# Altium schematic sheet Banks_5_6.SchDoc: FPGA Motherboard for Digital Multiplexed Readout, McGill U.
size B; DocumentNumber: DfMUX4; Revision: Rev0, Prototype; SheetNumber: 4; SheetTotal: 27; PageSetup: Record=PageOptions|CenterHorizontal=True|CenterVertical=True|PrintScale=1.08|XCorrection=1.00|YCorrection=1.00|PrintKind=0|BorderSize=5000000|LeftOffset=0|BottomOffset=0|Orientation=2|PaperLength=1000|PaperWidth=1000|Scale=100|PaperSource=7|PrintQuality=-4|MediaType=1|DitherType=10|PaperKind=Tabloid|PrintScaleMode=1
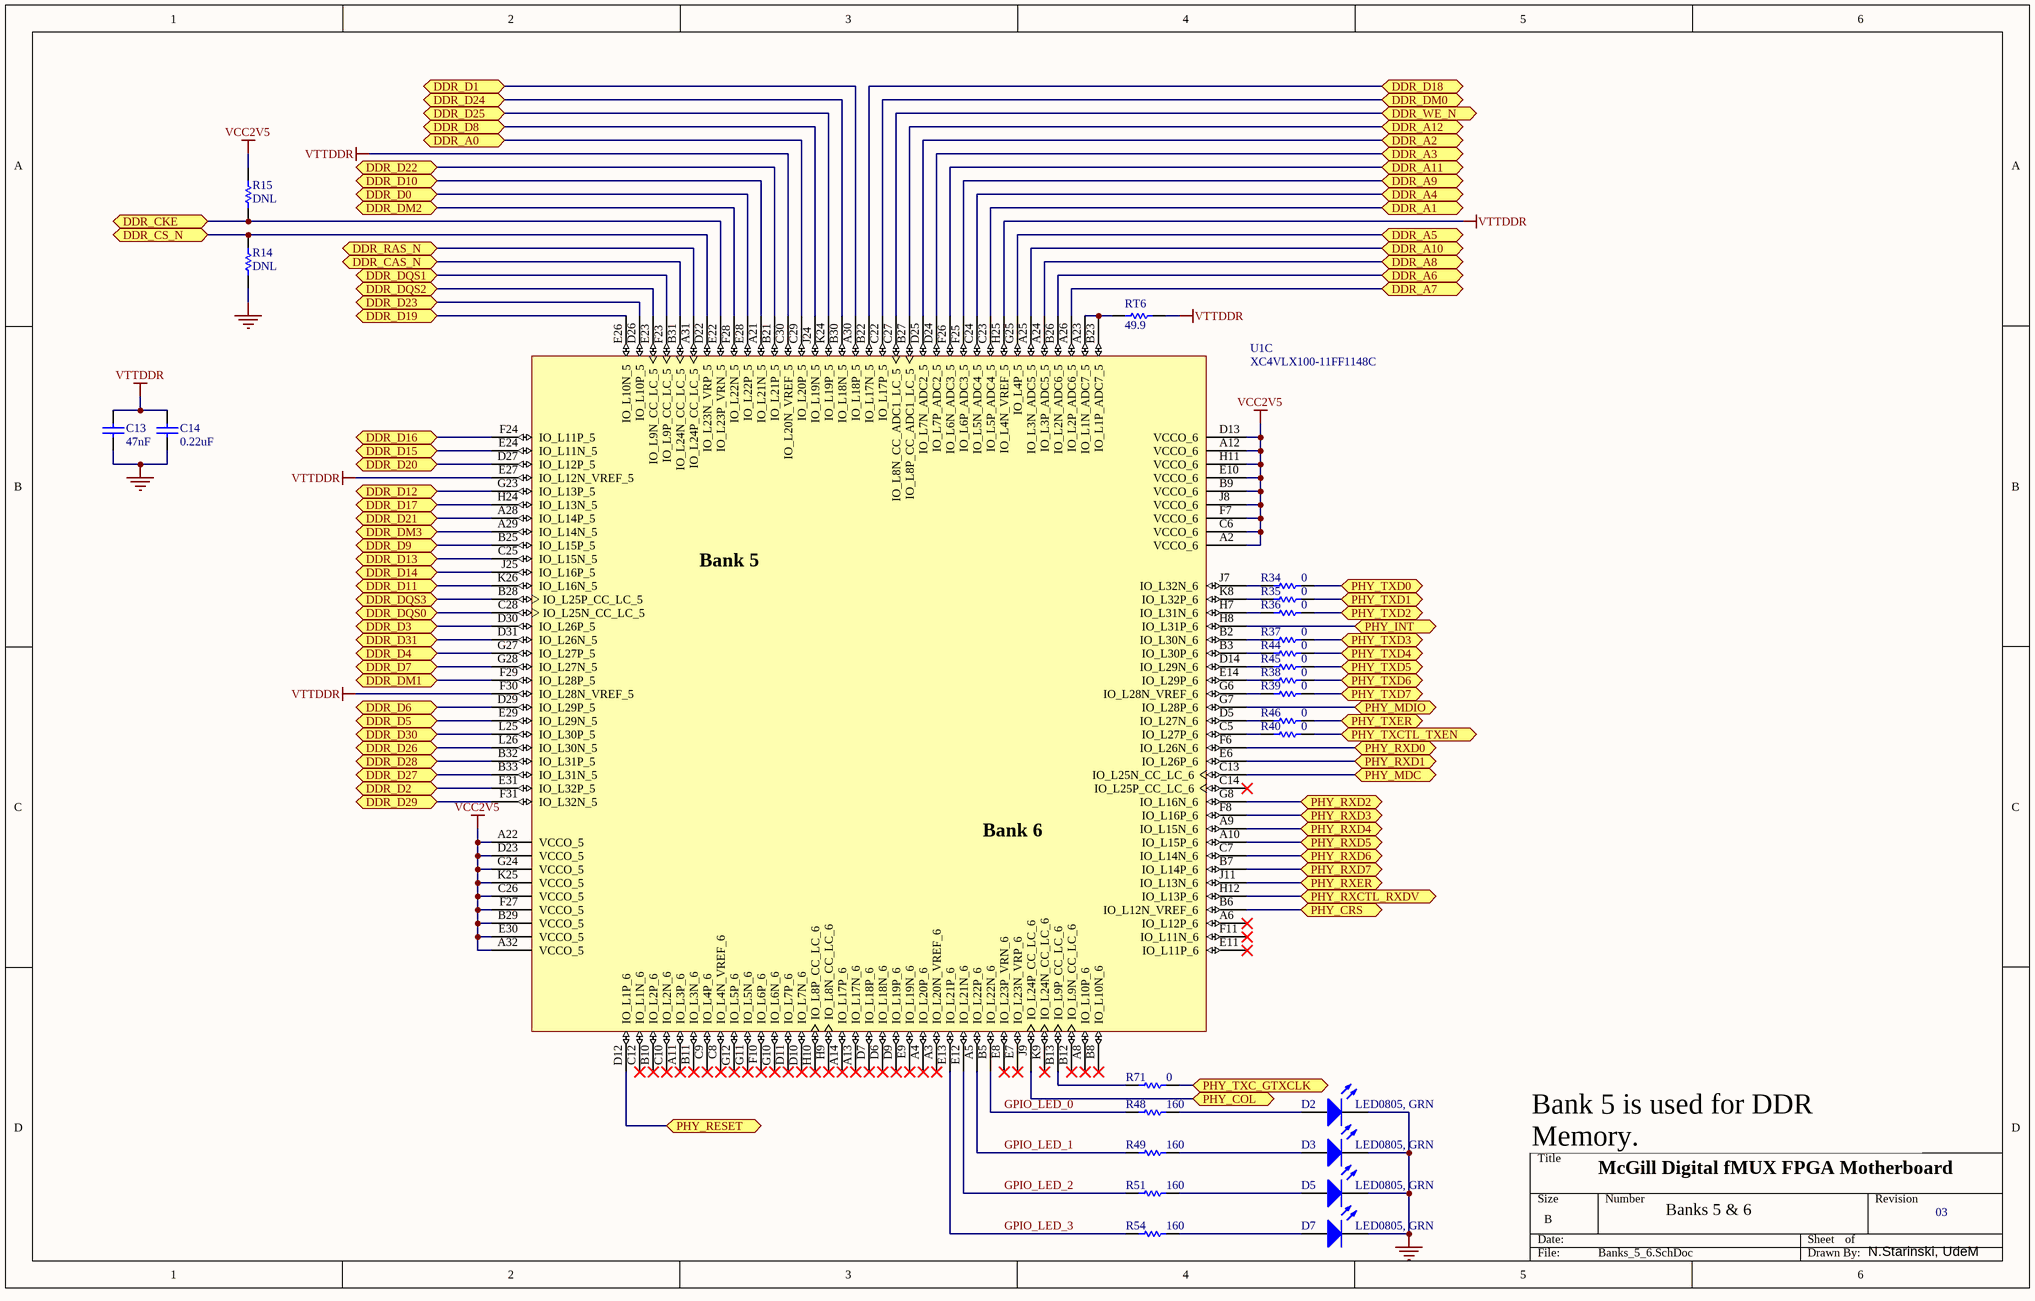
[diagram p0: Banks_5_6.SchDoc]

## Parts
C13  47nF  [CC1005-0402]
C14  0.22uF  [CC1608-0603]
D2  LED0805, GRN  [SMD _LED]
D3  LED0805, GRN  [SMD _LED]
D5  LED0805, GRN  [SMD _LED]
D7  LED0805, GRN  [SMD _LED]
R14  DNL  [CR1608-0603]
R15  DNL  [CR1608-0603]
R34  0  [CR1608-0603]
R35  0  [CR1608-0603]
R36  0  [CR1608-0603]
R37  0  [CR1608-0603]
R38  0  [CR1608-0603]
R39  0  [CR1608-0603]
R40  0  [CR1608-0603]
R44  0  [CR1608-0603]
R45  0  [CR1608-0603]
R46  0  [CR1608-0603]
R48  160  [CR1608-0603]
R49  160  [CR1608-0603]
R51  160  [CR1608-0603]
R54  160  [CR1608-0603]
R71  0  [CR1608-0603]
RT6  49.9  [CR1608-0603]
U1  XC4VLX100-11FF1148C  [FF1148]  (part C of 10)

## Ports
DDR_A0 (bidir), DDR_A1 (bidir), DDR_A2 (bidir), DDR_A3 (bidir), DDR_A4 (bidir), DDR_A5 (bidir), DDR_A6 (bidir), DDR_A7 (bidir), DDR_A8 (bidir), DDR_A9 (bidir), DDR_A10 (bidir), DDR_A11 (bidir), DDR_A12 (bidir), DDR_CAS_N (bidir), DDR_CKE (bidir), DDR_CS_N (bidir), DDR_D0 (bidir), DDR_D1 (bidir), DDR_D2 (bidir), DDR_D3 (bidir), DDR_D4 (bidir), DDR_D5 (bidir), DDR_D6 (bidir), DDR_D7 (bidir), DDR_D8 (bidir), DDR_D9 (bidir), DDR_D10 (bidir), DDR_D11 (bidir), DDR_D12 (bidir), DDR_D13 (bidir), DDR_D14 (bidir), DDR_D15 (bidir), DDR_D16 (bidir), DDR_D17 (bidir), DDR_D18 (bidir), DDR_D19 (bidir), DDR_D20 (bidir), DDR_D21 (bidir), DDR_D22 (bidir), DDR_D23 (bidir), DDR_D24 (bidir), DDR_D25 (bidir), DDR_D26 (bidir), DDR_D27 (bidir), DDR_D28 (bidir), DDR_D29 (bidir), DDR_D30 (bidir), DDR_D31 (bidir), DDR_DM0 (bidir), DDR_DM1 (bidir), DDR_DM2 (bidir), DDR_DM3 (bidir), DDR_DQS0 (bidir), DDR_DQS1 (bidir), DDR_DQS2 (bidir), DDR_DQS3 (bidir), DDR_RAS_N (bidir), DDR_WE_N (bidir), PHY_COL (bidir), PHY_CRS (bidir), PHY_INT (bidir), PHY_MDC (bidir), PHY_MDIO (bidir), PHY_RESET (bidir), PHY_RXCTL_RXDV (bidir), PHY_RXD0 (bidir), PHY_RXD1 (bidir), PHY_RXD2 (bidir), PHY_RXD3 (bidir), PHY_RXD4 (bidir), PHY_RXD5 (bidir), PHY_RXD6 (bidir), PHY_RXD7 (bidir), PHY_RXER (bidir), PHY_TXC_GTXCLK (bidir), PHY_TXCTL_TXEN (bidir), PHY_TXD0 (bidir), PHY_TXD1 (bidir), PHY_TXD2 (bidir), PHY_TXD3 (bidir), PHY_TXD4 (bidir), PHY_TXD5 (bidir), PHY_TXD6 (bidir), PHY_TXD7 (bidir), PHY_TXER (bidir)

## Nets
GND: C13.1 C14.1 D2.2(K) D3.2(K) D5.2(K) D7.2(K) R14.1
VCC2V5: R15.2 U1.A2(VCCO_6) U1.A12(VCCO_6) U1.A22(VCCO_5) U1.A32(VCCO_5) U1.B9(VCCO_6) U1.B29(VCCO_5) U1.C6(VCCO_6) U1.C26(VCCO_5) U1.D13(VCCO_6) U1.D23(VCCO_5) U1.E10(VCCO_6) U1.E30(VCCO_5) U1.F7(VCCO_6) U1.F27(VCCO_5) U1.G24(VCCO_5) U1.H11(VCCO_6) U1.J8(VCCO_6) U1.K25(VCCO_5)
VTTDDR: C13.2 C14.2 RT6.2 U1.C30(IO_L20N_VREF_5) U1.E27(IO_L12N_VREF_5) U1.F30(IO_L28N_VREF_5) U1.H25(IO_L4N_VREF_5)
DDR_A0: U1.C29(IO_L20P_5) ; port DDR_A0
DDR_A1: U1.C23(IO_L5P_ADC4_5) ; port DDR_A1
DDR_A2: U1.D25(IO_L7N_ADC2_5) ; port DDR_A2
DDR_A3: U1.D24(IO_L7P_ADC2_5) ; port DDR_A3
DDR_A4: U1.C24(IO_L5N_ADC4_5) ; port DDR_A4
DDR_A5: U1.G25(IO_L4P_5) ; port DDR_A5
DDR_A6: U1.B26(IO_L2N_ADC6_5) ; port DDR_A6
DDR_A7: U1.A26(IO_L2P_ADC6_5) ; port DDR_A7
DDR_A8: U1.A24(IO_L3P_ADC5_5) ; port DDR_A8
DDR_A9: U1.F25(IO_L6P_ADC3_5) ; port DDR_A9
DDR_A10: U1.A25(IO_L3N_ADC5_5) ; port DDR_A10
DDR_A11: U1.F26(IO_L6N_ADC3_5) ; port DDR_A11
DDR_A12: U1.B27(IO_L8P_CC_ADC1_LC_5) ; port DDR_A12
DDR_CAS_N: U1.B31(IO_L24N_CC_LC_5) ; port DDR_CAS_N
DDR_CKE: R15.1 U1.E22(IO_L23P_VRN_5) ; port DDR_CKE
DDR_CS_N: R14.2 U1.D22(IO_L23N_VRP_5) ; port DDR_CS_N
DDR_D0: U1.E28(IO_L22P_5) ; port DDR_D0
DDR_D1: U1.A30(IO_L18P_5) ; port DDR_D1
DDR_D2: U1.E31(IO_L32P_5) ; port DDR_D2
DDR_D3: U1.D30(IO_L26P_5) ; port DDR_D3
DDR_D4: U1.G27(IO_L27P_5) ; port DDR_D4
DDR_D5: U1.E29(IO_L29N_5) ; port DDR_D5
DDR_D6: U1.D29(IO_L29P_5) ; port DDR_D6
DDR_D7: U1.G28(IO_L27N_5) ; port DDR_D7
DDR_D8: U1.J24(IO_L19N_5) ; port DDR_D8
DDR_D9: U1.B25(IO_L15P_5) ; port DDR_D9
DDR_D10: U1.A21(IO_L21N_5) ; port DDR_D10
DDR_D11: U1.K26(IO_L16N_5) ; port DDR_D11
DDR_D12: U1.G23(IO_L13P_5) ; port DDR_D12
DDR_D13: U1.C25(IO_L15N_5) ; port DDR_D13
DDR_D14: U1.J25(IO_L16P_5) ; port DDR_D14
DDR_D15: U1.E24(IO_L11N_5) ; port DDR_D15
DDR_D16: U1.F24(IO_L11P_5) ; port DDR_D16
DDR_D17: U1.H24(IO_L13N_5) ; port DDR_D17
DDR_D18: U1.B22(IO_L17N_5) ; port DDR_D18
DDR_D19: U1.E26(IO_L10N_5) ; port DDR_D19
DDR_D20: U1.D27(IO_L12P_5) ; port DDR_D20
DDR_D21: U1.A28(IO_L14P_5) ; port DDR_D21
DDR_D22: U1.B21(IO_L21P_5) ; port DDR_D22
DDR_D23: U1.D26(IO_L10P_5) ; port DDR_D23
DDR_D24: U1.B30(IO_L18N_5) ; port DDR_D24
DDR_D25: U1.K24(IO_L19P_5) ; port DDR_D25
DDR_D26: U1.L26(IO_L30N_5) ; port DDR_D26
DDR_D27: U1.B33(IO_L31N_5) ; port DDR_D27
DDR_D28: U1.B32(IO_L31P_5) ; port DDR_D28
DDR_D29: U1.F31(IO_L32N_5) ; port DDR_D29
DDR_D30: U1.L25(IO_L30P_5) ; port DDR_D30
DDR_D31: U1.D31(IO_L26N_5) ; port DDR_D31
DDR_DM0: U1.C22(IO_L17P_5) ; port DDR_DM0
DDR_DM1: U1.F29(IO_L28P_5) ; port DDR_DM1
DDR_DM2: U1.F28(IO_L22N_5) ; port DDR_DM2
DDR_DM3: U1.A29(IO_L14N_5) ; port DDR_DM3
DDR_DQS0: U1.C28(IO_L25N_CC_LC_5) ; port DDR_DQS0
DDR_DQS1: U1.F23(IO_L9P_CC_LC_5) ; port DDR_DQS1
DDR_DQS2: U1.E23(IO_L9N_CC_LC_5) ; port DDR_DQS2
DDR_DQS3: U1.B28(IO_L25P_CC_LC_5) ; port DDR_DQS3
DDR_RAS_N: U1.A31(IO_L24P_CC_LC_5) ; port DDR_RAS_N
DDR_WE_N: U1.C27(IO_L8N_CC_ADC1_LC_5) ; port DDR_WE_N
GPIO_LED_0: R48.1 U1.B5(IO_L22N_6)
GPIO_LED_1: R49.1 U1.A5(IO_L22P_6)
GPIO_LED_2: R51.1 U1.E12(IO_L21N_6)
GPIO_LED_3: R54.1 U1.E13(IO_L21P_6)
PHY_COL: U1.J9(IO_L24P_CC_LC_6) ; port PHY_COL
PHY_CRS: U1.B6(IO_L12N_VREF_6) ; port PHY_CRS
PHY_INT: U1.H8(IO_L31P_6) ; port PHY_INT
PHY_MDC: U1.C13(IO_L25N_CC_LC_6) ; port PHY_MDC
PHY_MDIO: U1.G7(IO_L28P_6) ; port PHY_MDIO
PHY_RESET: U1.D12(IO_L1P_6) ; port PHY_RESET
PHY_RXCTL_RXDV: U1.H12(IO_L13P_6) ; port PHY_RXCTL_RXDV
PHY_RXD0: U1.F6(IO_L26N_6) ; port PHY_RXD0
PHY_RXD1: U1.E6(IO_L26P_6) ; port PHY_RXD1
PHY_RXD2: U1.G8(IO_L16N_6) ; port PHY_RXD2
PHY_RXD3: U1.F8(IO_L16P_6) ; port PHY_RXD3
PHY_RXD4: U1.A9(IO_L15N_6) ; port PHY_RXD4
PHY_RXD5: U1.A10(IO_L15P_6) ; port PHY_RXD5
PHY_RXD6: U1.C7(IO_L14N_6) ; port PHY_RXD6
PHY_RXD7: U1.B7(IO_L14P_6) ; port PHY_RXD7
PHY_RXER: U1.J11(IO_L13N_6) ; port PHY_RXER
PHY_TXC_GTXCLK: R71.2 ; port PHY_TXC_GTXCLK
PHY_TXCTL_TXEN: R40.2 ; port PHY_TXCTL_TXEN
PHY_TXD0: R34.2 ; port PHY_TXD0
PHY_TXD1: R35.2 ; port PHY_TXD1
PHY_TXD2: R36.2 ; port PHY_TXD2
PHY_TXD3: R37.2 ; port PHY_TXD3
PHY_TXD4: R44.2 ; port PHY_TXD4
PHY_TXD5: R45.2 ; port PHY_TXD5
PHY_TXD6: R38.2 ; port PHY_TXD6
PHY_TXD7: R39.2 ; port PHY_TXD7
PHY_TXER: R46.2 ; port PHY_TXER
NetD2_1: D2.1(A) R48.2
NetD3_1: D3.1(A) R49.2
NetD5_1: D5.1(A) R51.2
NetD7_1: D7.1(A) R54.2
NetR34_1: R34.1 U1.J7(IO_L32N_6)
NetR35_1: R35.1 U1.K8(IO_L32P_6)
NetR36_1: R36.1 U1.H7(IO_L31N_6)
NetR37_1: R37.1 U1.B2(IO_L30N_6)
NetR38_1: R38.1 U1.E14(IO_L29P_6)
NetR39_1: R39.1 U1.G6(IO_L28N_VREF_6)
NetR40_1: R40.1 U1.C5(IO_L27P_6)
NetR44_1: R44.1 U1.B3(IO_L30P_6)
NetR45_1: R45.1 U1.D14(IO_L29N_6)
NetR46_1: R46.1 U1.D5(IO_L27N_6)
NetR71_1: R71.1 U1.B13(IO_L9P_CC_LC_6)
NetRT6_1: RT6.1 U1.A23(IO_L1N_ADC7_5) U1.B23(IO_L1P_ADC7_5)

Not connected (* = marked no-connect by the designer): U1 A3(IO_L20N_VREF_6)* A4(IO_L20P_6)* A6(IO_L12P_6)* A8(IO_L10P_6)* A11(IO_L3P_6)* A13(IO_L17N_6)* A14(IO_L17P_6)* B8(IO_L10N_6)* B10(IO_L2P_6)* B11(IO_L3N_6)* B12(IO_L9N_CC_LC_6)* C8(IO_L4N_VREF_6)* C9(IO_L4P_6)* C10(IO_L2N_6)* C12(IO_L1N_6)* C14(IO_L25P_CC_LC_6)* D6(IO_L18N_6)* D7(IO_L18P_6)* D9(IO_L19P_6)* D10(IO_L7N_6)* D11(IO_L7P_6)* E7(IO_L23N_VRP_6)* E8(IO_L23P_VRN_6)* E9(IO_L19N_6)* E11(IO_L11P_6)* F10(IO_L6P_6)* F11(IO_L11N_6)* G10(IO_L6N_6)* G11(IO_L5N_6)* G12(IO_L5P_6)* H9(IO_L8N_CC_LC_6)* H10(IO_L8P_CC_LC_6)* K9(IO_L24N_CC_LC_6)*

## Notes on the sheet
- Bank 5 is used for DDR Memory.
  Bank 6 is used for PHY.
- McGill Digital fMUX FPGA Motherboard
- Banks 5 & 6
- 03
- N.Starinski, UdeM
- (in symbol XC4VLX100-11FF1148C, part C) Bank 5; Bank 6

## Library data of the parts
C13 C14 = Cap Semi: Capacitor (Semiconductor SIM Model); Published: 8-Jun-2000; LatestRevisionDate: 17-Jul-2002; LatestRevisionNote: Re-released for DXP Platform.; PackageReference: C1206; Publisher: Altium Limited
D2 D3 D5 D7 = LED3: LED 0805 LTST-C170GKT; Published: 8-Jun-2000; LatestRevisionDate: 17-Dec-2003; LatestRevisionNote: PCB Footprint replaced.; Publisher: Altium Limited
R14 R15 = Res Semi: Semiconductor Resistor; Published: 8-Jun-2000; LatestRevisionDate: 17-Jul-2002; LatestRevisionNote: Re-released for DXP Platform.; Publisher: Altium Limited
R34-R40 R44-R46 R48 R49 R51 R54 R71 RT6 = Res Semi: Resistor 0603; Published: 8-Jun-2000; LatestRevisionDate: 17-Jul-2002; LatestRevisionNote: Re-released for DXP Platform.; Publisher: Altium Limited
U1 = XC4VLX100-11FF1148C: Xilinx Virtex-4 LX Platform FPGA, 1148-Ball FFBGA, Speed Grade 11, 768 User I/Os, Commercial Grade; PackageDocument: ver1.0, Oct-2002; Published: 13-Dec-2004; LatestRevisionDate: 4-Mar-2005; LatestRevisionNote: D_IN & CS_B pins changed from I/O to Input. DOUT_BUSY pin changed from I/O to Output.; DatasheetDocument: ver1.2, Dec-2004; PackageReference: FF1148; Publisher: Altium Limited; ComponentLink2Description: Virtex-4 Overview; ComponentLink2URL: http://www.xilinx.com/products/virtex4/overview.htm; ComponentLink3Description: Datasheet; ComponentLink3URL: http://direct.xilinx.com/bvdocs/userguides/ug075.pdf; Code_JEDEC: MS-034-AAR-1